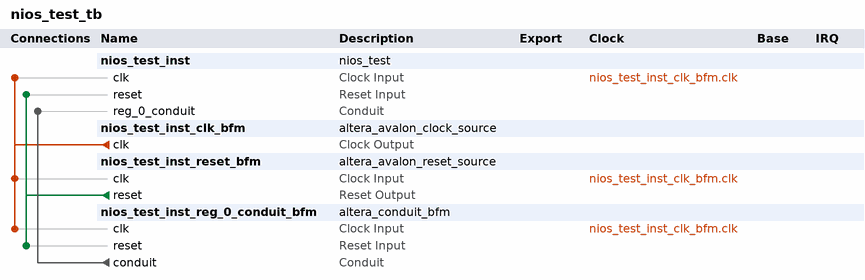
[diagram p0: system contents]
# Platform Designer (Qsys) system nios_test_tb, Cyclone II EP2C35F672C7
# Parameters at their usual value, and those the tool derives, are not listed.
package require -exact qsys 13.0
create_system nios_test_tb
set_project_property DEVICE_FAMILY {Cyclone II}
set_project_property DEVICE EP2C35F672C7

add_instance nios_test_inst nios_test 1.0

add_instance nios_test_inst_clk_bfm altera_avalon_clock_source 13.0

add_instance nios_test_inst_reset_bfm altera_avalon_reset_source 13.0
set_instance_parameter_value nios_test_inst_reset_bfm ASSERT_HIGH_RESET 0
set_instance_parameter_value nios_test_inst_reset_bfm INITIAL_RESET_CYCLES 50

add_instance nios_test_inst_reg_0_conduit_bfm altera_conduit_bfm 13.0
set_instance_parameter_value nios_test_inst_reg_0_conduit_bfm CLOCKED_SIGNAL true
set_instance_parameter_value nios_test_inst_reg_0_conduit_bfm ENABLE_RESET true
set_instance_parameter_value nios_test_inst_reg_0_conduit_bfm SIGNAL_ROLES AVINTDIS,T1INTOVR,T1INTSTS,T0INTSTS,T1INTEN,T0INTEN,T1CNTEN,T0CNTEN,T1RST,T0RST,T0CNT,T1CNT,T0CMP,T1CMP,GP0,GP1
set_instance_parameter_value nios_test_inst_reg_0_conduit_bfm SIGNAL_WIDTHS 1,1,1,1,1,1,1,1,1,1,32,32,32,32,32,32
set_instance_parameter_value nios_test_inst_reg_0_conduit_bfm SIGNAL_DIRECTIONS input,input,input,input,input,input,input,input,input,input,input,input,input,input,input,input

# connections
add_connection nios_test_inst_clk_bfm.clk nios_test_inst.clk clock
add_connection nios_test_inst_clk_bfm.clk nios_test_inst_reg_0_conduit_bfm.clk clock
add_connection nios_test_inst_clk_bfm.clk nios_test_inst_reset_bfm.clk clock
add_connection nios_test_inst_reset_bfm.reset nios_test_inst.reset reset
add_connection nios_test_inst_reset_bfm.reset nios_test_inst_reg_0_conduit_bfm.reset reset
add_connection nios_test_inst_reg_0_conduit_bfm.conduit nios_test_inst.reg_0_conduit conduit

set_interconnect_requirement {$system} qsys_mm.clockCrossingAdapter HANDSHAKE
set_interconnect_requirement {$system} qsys_mm.maxAdditionalLatency 1

save_system nios_test_tb.qsys
